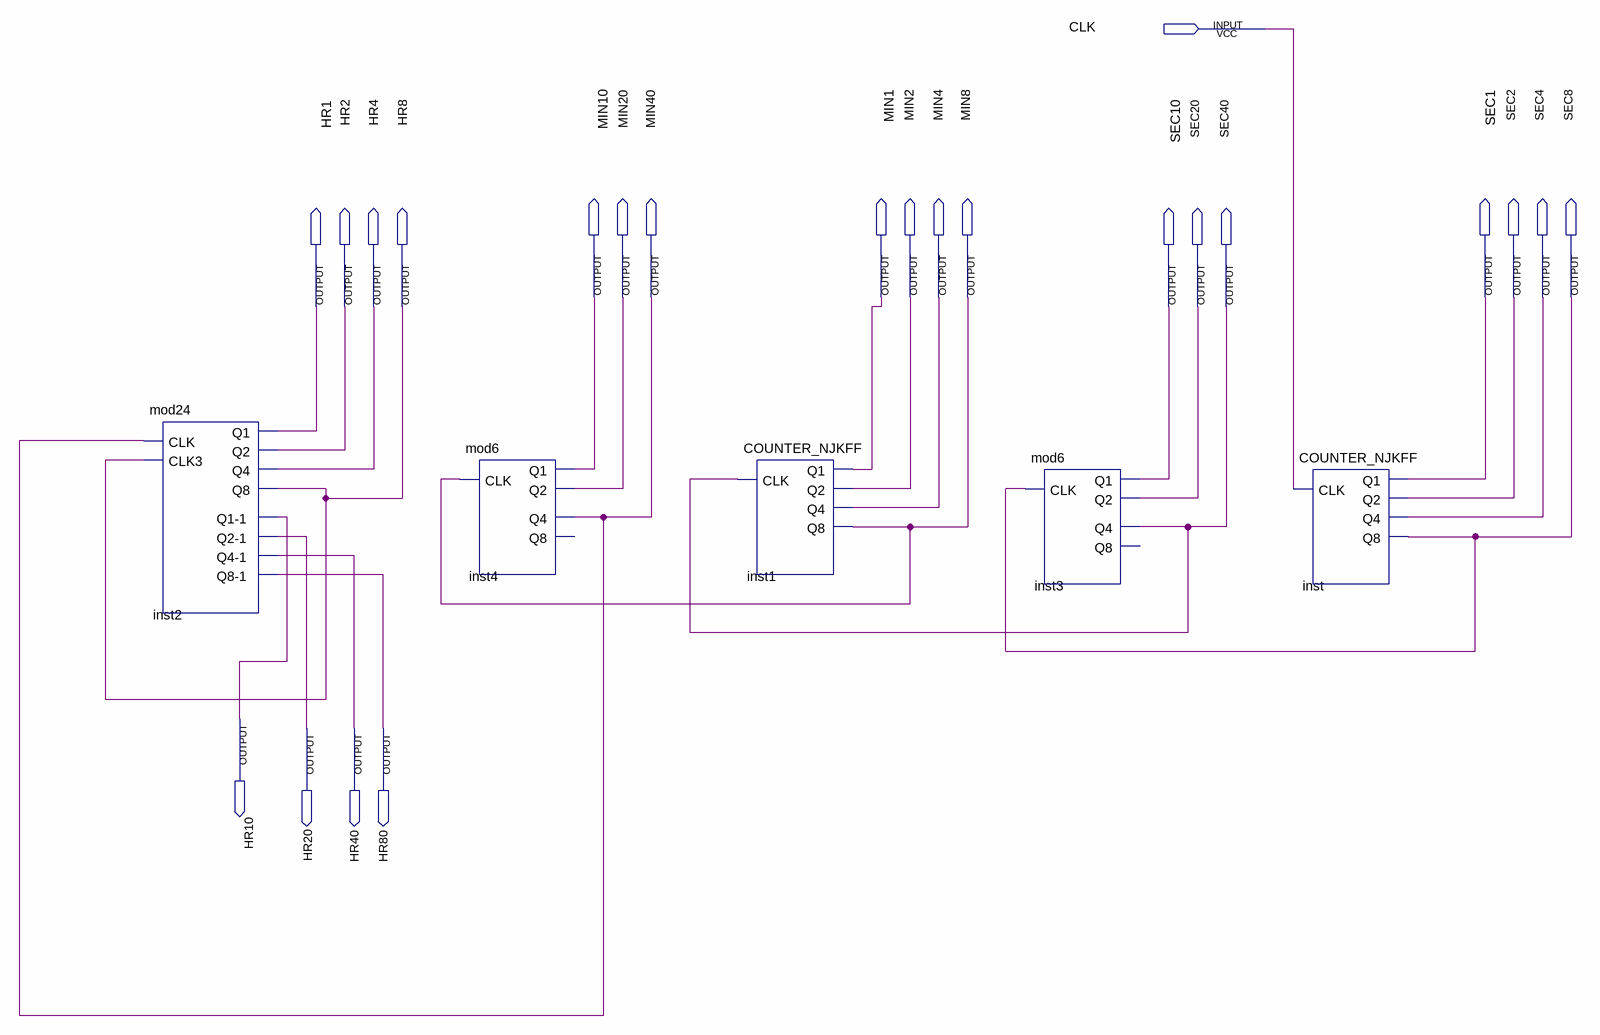
[diagram p0: schematic sheet]
// Quartus schematic TwentyFourHR.bdf as structural Verilog: 5 symbols, 23 pins
module TwentyFourHR (
  input  CLK,
  output MIN10,
  output MIN20,
  output MIN40,
  output MIN1,
  output MIN2,
  output MIN4,
  output MIN8,
  output SEC1,
  output SEC2,
  output SEC4,
  output SEC8,
  output HR1,
  output HR2,
  output HR4,
  output HR8,
  output SEC10,
  output SEC20,
  output SEC40,
  output HR10,
  output HR20,
  output HR40,
  output HR80
);

  mod24 inst2 (
    .CLK(MIN40), .CLK3(HR8), .Q2(HR2), .Q8(HR8), .Q1(HR1), .Q4(HR4), .\Q2-1 (HR20), .\Q8-1 (HR80),
    .\Q1-1 (HR10), .\Q4-1 (HR40));
  mod6 inst4 (.CLK(MIN8), .Q2(MIN20), .Q1(MIN10), .Q4(MIN40));  // open: Q8
  COUNTER_NJKFF inst1 (.CLK(SEC40), .Q2(MIN2), .Q8(MIN8), .Q1(MIN1), .Q4(MIN4));
  mod6 inst3 (.CLK(SEC8), .Q2(SEC20), .Q1(SEC10), .Q4(SEC40));  // open: Q8
  COUNTER_NJKFF inst (.CLK(CLK), .Q2(SEC2), .Q8(SEC8), .Q1(SEC1), .Q4(SEC4));
endmodule
